# Altium project Redstone.PrjPcb
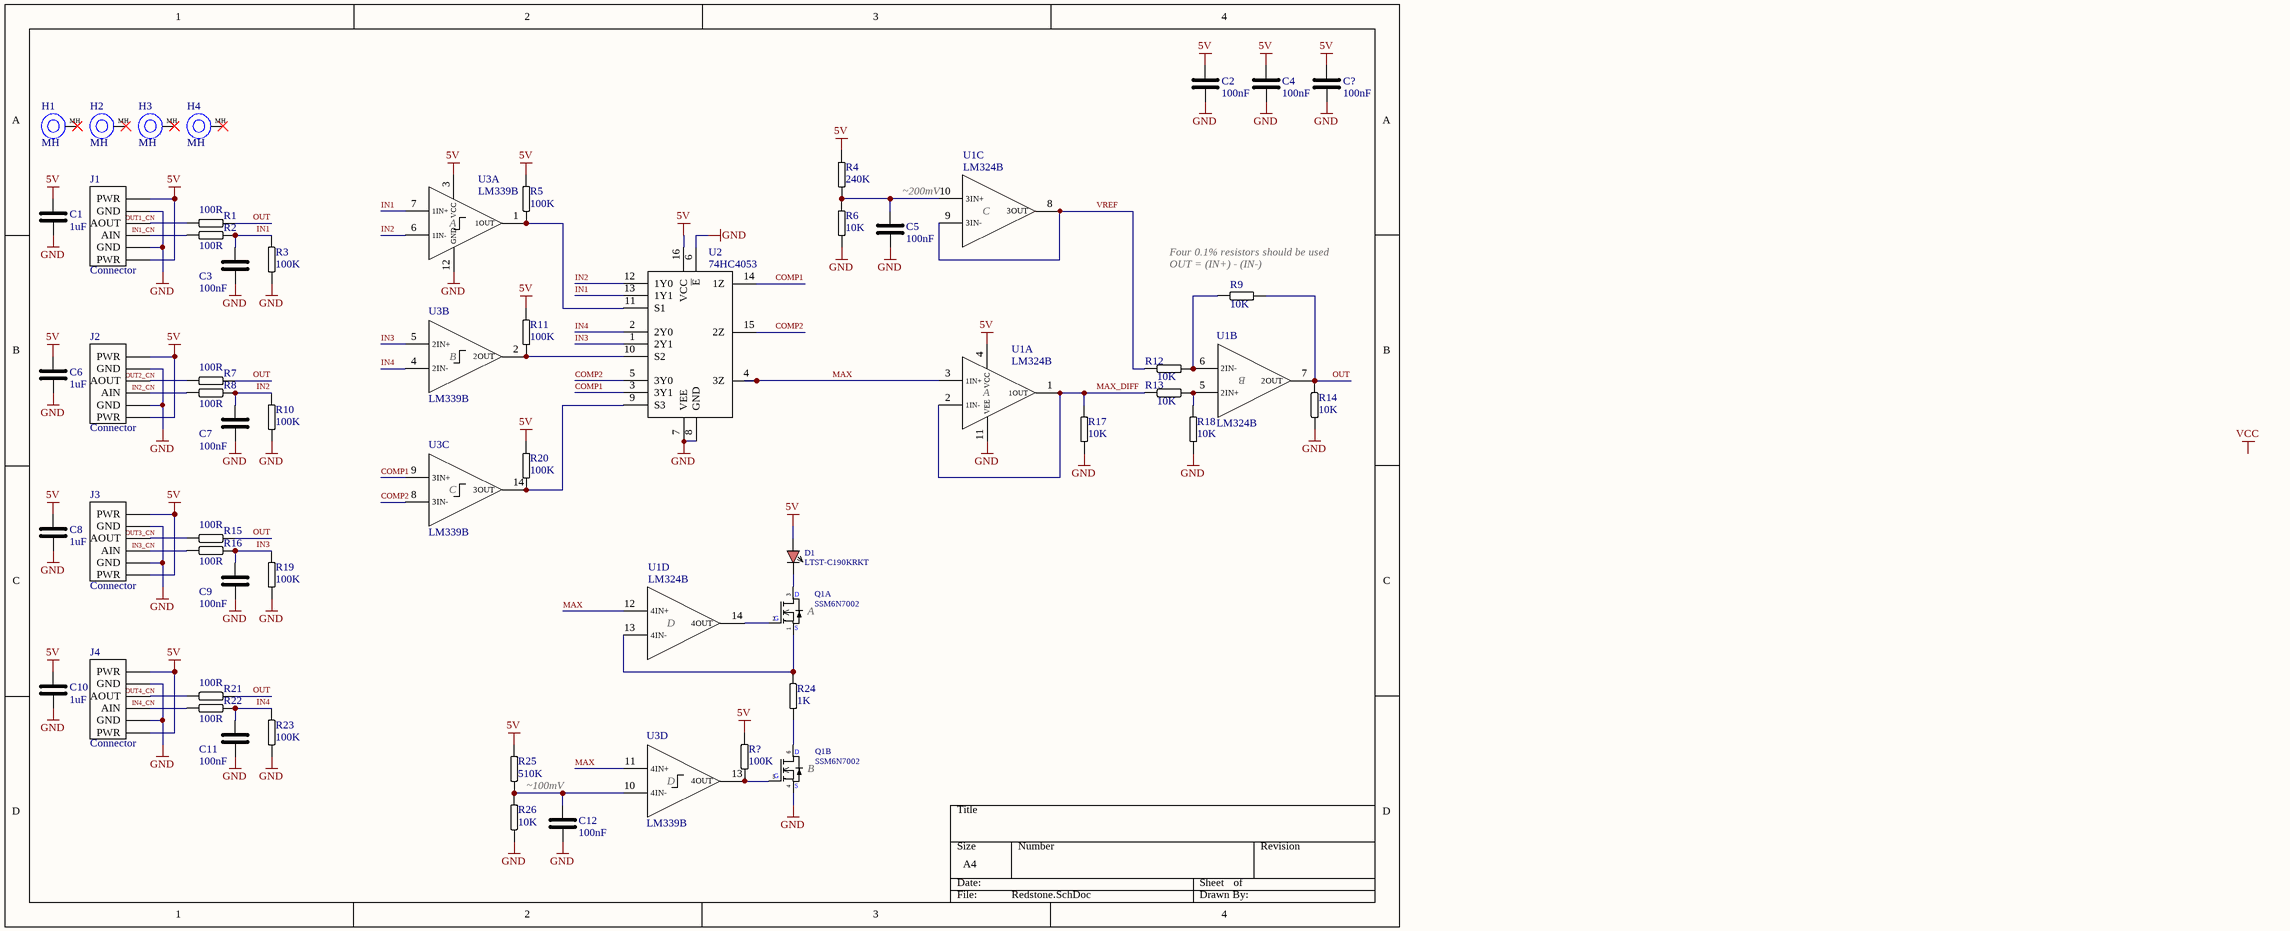
[diagram p0: Redstone.SchDoc]
1 sheet, 53 parts. Net scope: global (net labels, ports and power ports of the same name join across sheets).
Board file: Redstone.PcbDoc

## Sheet Redstone.SchDoc
size A4; SheetNumber: 1; SheetTotal: 1

### Parts
C1  1uF  [CAP0603]
C2  100nF  [CAP0603]
C3  100nF  [CAP0603]
C4  100nF  [CAP0603]
C5  100nF  [CAP0603]
C6  1uF  [CAP0603]
C7  100nF  [CAP0603]
C8  1uF  [CAP0603]
C9  100nF  [CAP0603]
C10  1uF  [CAP0603]
C11  100nF  [CAP0603]
C12  100nF  [CAP0603]
C?  100nF  [CAP0603]
D1  LTST-C190KRKT  [LED0603]
H1  MH  [MOUNTING_HOLE_M2.5]
H2  MH  [MOUNTING_HOLE_M2.5]
H3  MH  [MOUNTING_HOLE_M2.5]
H4  MH  [MOUNTING_HOLE_M2.5]
J1  Connector  [CONNECTOR]
J2  Connector  [CONNECTOR]
J3  Connector  [CONNECTOR]
J4  Connector  [CONNECTOR]
Q1  SSM6N7002  [SOT-363-6]  (parts A,B of 2)
R1  100R  [RES0603]
R2  100R  [RES0603]
R3  100K  [RES0603]
R4  240K  [RES0603]
R5  100K  [RES0603]
R6  10K  [RES0603]
R7  100R  [RES0603]
R8  100R  [RES0603]
R9  10K  [RES0603]
R10  100K  [RES0603]
R11  100K  [RES0603]
R12  10K  [RES0603]
R13  10K  [RES0603]
R14  10K  [RES0603]
R15  100R  [RES0603]
R16  100R  [RES0603]
R17  10K  [RES0603]
R18  10K  [RES0603]
R19  100K  [RES0603]
R20  100K  [RES0603]
R21  100R  [RES0603]
R22  100R  [RES0603]
R23  100K  [RES0603]
R24  1K  [RES0603]
R25  510K  [RES0603]
R26  10K  [RES0603]
R?  100K  [RES0603]
U1  LM324B  [TSSOP_14P]  (parts A,B,C,D of 4)
U2  74HC4053  [TSSOP_16P]
U3  LM339B  [TSSOP_16P]  (parts A,B,C,D of 4)

### Nets
5V: C1.1 C2.1 C4.1 C6.1 C8.1 C10.1 C?.1 D1.A J1.1(PWR) J1.6(PWR) J2.1(PWR) J2.6(PWR) J3.1(PWR) J3.6(PWR) J4.1(PWR) J4.6(PWR) R4.2 R5.1 R11.1 R20.1 R25.2 R?.1 U1.4(VCC) U2.16(VCC) U3.3(VCC)
GND: C1.2 C2.2 C3.2 C4.2 C5.2 C6.2 C7.2 C8.2 C9.2 C10.2 C11.2 C12.2 C?.2 J1.2(GND) J1.5(GND) J2.2(GND) J2.5(GND) J3.2(GND) J3.5(GND) J4.2(GND) J4.5(GND) Q1.4(S) R3.2 R6.1 R10.2 R14.1 R17.2 R18.1 R19.2 R23.2 R26.1 U1.11(VEE) U2.6(~{E}) U2.7(VEE) U2.8(GND) U3.12(GND)
COMP1: U2.3(3Y1) U2.14(1Z) U3.9(3IN+)
COMP2: U2.5(3Y0) U2.15(2Z) U3.8(3IN-)
IN1: C3.1 R2.2 R3.1 U2.13(1Y1) U3.7(1IN+)
IN1_CN: J1.3(AIN) R2.1
IN2: C7.1 R8.2 R10.1 U2.12(1Y0) U3.6(1IN-)
IN2_CN: J2.3(AIN) R8.1
IN3: C9.1 R16.2 R19.1 U2.1(2Y1) U3.5(2IN+)
IN3_CN: J3.3(AIN) R16.1
IN4: C11.1 R22.2 R23.1 U2.2(2Y0) U3.4(2IN-)
IN4_CN: J4.3(AIN) R22.1
MAX: U1.3(1IN+) U1.12(4IN+) U2.4(3Z) U3.11(4IN+)
MAX_DIFF: R13.2 R17.1 U1.1(1OUT) U1.2(1IN-)
OUT: R1.2 R7.2 R9.1 R14.2 R15.2 R21.2 U1.7(2OUT)
OUT1_CN: J1.4(AOUT) R1.1
OUT2_CN: J2.4(AOUT) R7.1
OUT3_CN: J3.4(AOUT) R15.1
OUT4_CN: J4.4(AOUT) R21.1
VREF: R12.2 U1.8(3OUT) U1.9(3IN-)
NetC5_1: C5.1 R4.1 R6.2 U1.10(3IN+)
NetC12_1: C12.1 R25.1 R26.2 U3.10(4IN-)
NetD1_C: D1.C Q1.3(D)
NetQ1_1: Q1.1(S) R24.2 U1.13(4IN-)
NetQ1_2: Q1.2(G) U1.14(4OUT)
NetQ1_5: Q1.5(G) R?.2 U3.13(4OUT)
NetQ1_6: Q1.6(D) R24.1
NetR5_2: R5.2 U2.11(S1) U3.1(1OUT)
NetR9_2: R9.2 R12.1 U1.6(2IN-)
NetR11_2: R11.2 U2.10(S2) U3.2(2OUT)
NetR13_1: R13.1 R18.2 U1.5(2IN+)
NetR20_2: R20.2 U2.9(S3) U3.14(3OUT)

Not connected (* = marked no-connect by the designer): H1 MH*; H2 MH*; H3 MH*; H4 MH*

### Notes on the sheet
- ~200mV
- (near R9) Four 0.1% resistors should be used
- (near R9) OUT = (IN+) - (IN-)
- ~100mV
- Labels drawn without touching a wire or pin: VCC
- (in symbol LM324BIPWR, part A) A
- (in symbol LM324BIPWR, part B) B
- (in symbol LM324BIPWR, part C) C
- (in symbol LM324BIPWR, part D) D
- (in symbol LM339BIPWR, part A) A
- (in symbol LM339BIPWR, part B) B
- (in symbol LM339BIPWR, part C) C
- (in symbol LM339BIPWR, part D) D
- (in symbol SSM6N7002KFULF, part A) A
- (in symbol SSM6N7002KFULF, part B) B

### Library data of the parts
C1-C12 C? = Capacitor
H1-H4 = MountingHole
Q1 = SSM6N7002KFULF: Supplier: Mouser; Supplier Part Number: 757-SSM6N7002KFULF
R1-R26 R? = Resistor
U1 = LM324BIPWR: Supplier: Mouser; Supplier Part Number: 595-LM324BIPWR
U2 = 74HC4053PW,118: Supplier: Mouser; Supplier Part Number: 771-74HC4053PW-T
U3 = LM339BIPWR: Supplier: Mouser; Supplier Part Number: 595-LM339BIPWR
D1 = LTST-C190KRKT: Supplier: Mouser; Supplier Part Number: 859-LTST-C190KRKT